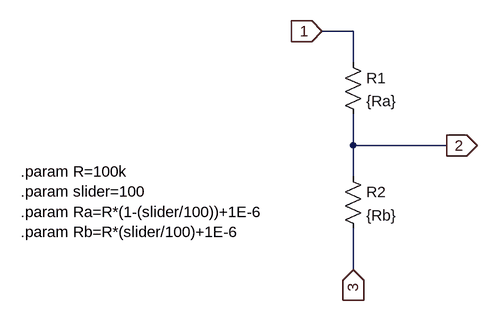
[diagram p0: schematic master_volume.asc]
master_volume.asc, the LTspice schematic file:
Version 4.1
SHEET 1 880 680
WIRE 176 16 128 16
WIRE 176 64 176 16
WIRE 176 192 176 144
WIRE 320 192 176 192
WIRE 176 240 176 192
WIRE 176 384 176 320
FLAG 128 16 1
IOPIN 128 16 In
FLAG 320 192 2
IOPIN 320 192 Out
FLAG 176 384 3
IOPIN 176 384 In
SYMBOL res 160 48 R0
SYMATTR InstName R1
SYMATTR Value {Ra}
SYMBOL res 160 224 R0
SYMATTR InstName R2
SYMATTR Value {Rb}
TEXT -336 232 Left 2 !.param R=100k\n.param slider=100\n.param Ra=R*(1-(slider/100))+1E-6\n.param Rb=R*(slider/100)+1E-6

The netlist it stands for:
* master_volume.asc
R1 1 2 {Ra}
R2 2 3 {Rb}
.param R=100k
.param slider=100
.param Ra=R*(1-(slider/100))+1E-6
.param Rb=R*(slider/100)+1E-6
.backanno
.end